# EasyEDA Pro project stm32wb09ke最小系统板_sma.eprj

# Schematic Schematic1
Board Name: Board1; Create Date: 2024-12-12; Page Name: P1; Project Name: stm32wb09ke最小系统板; Schematic Name: Schematic1; Update Date: 2025-01-03; Company: 东北林业大学; Page Size: A4; Version: V1.0
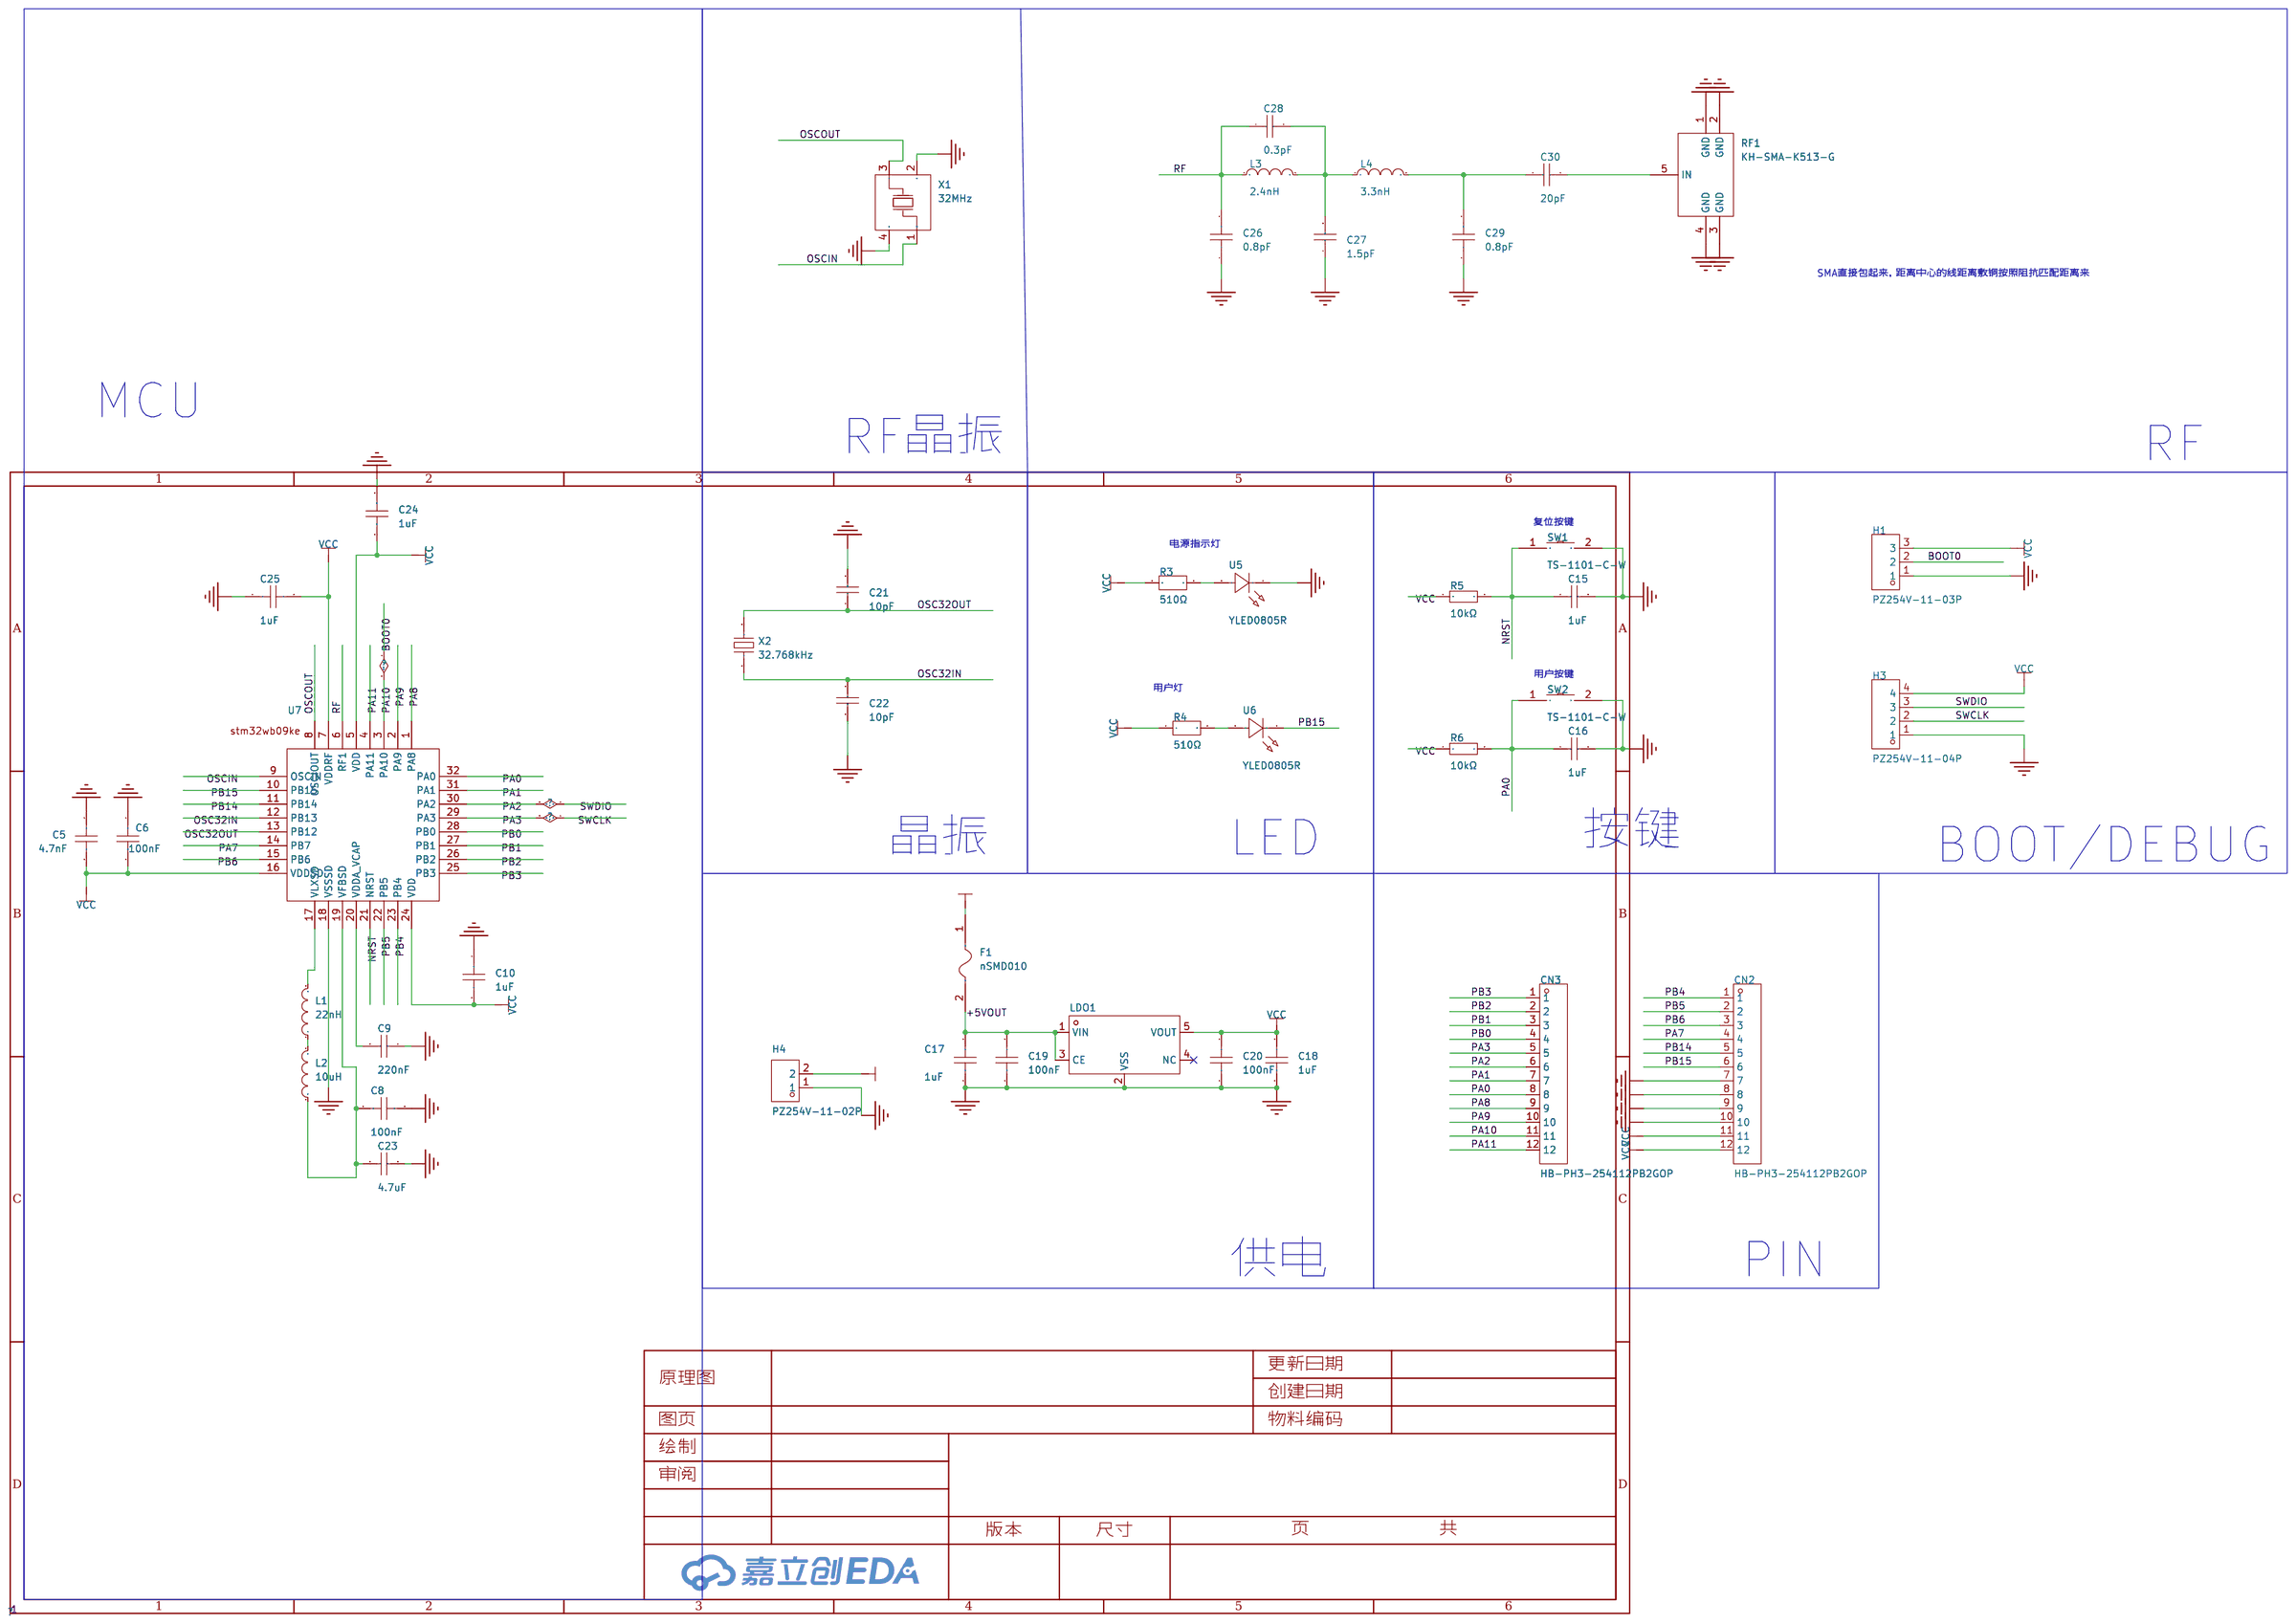
[diagram p0: schematic sheet]

## Parts
C5  4.7nF  [C0603]
C6  100nF  [C0603]
C8  100nF  [C0603]
C9  220nF  [C0603]
C10  1uF  [C0603]
C15  1uF  [C0805]
C16  1uF  [C0805]
C17  1uF  [C0603]
C18  1uF  [C0603]
C19  100nF  [C0603]
C20  100nF  [C0603]
C21  10pF  [C0603]
C22  10pF  [C0603]
C23  4.7uF  [C0603]
C24  1uF  [C0603]
C25  1uF  [C0603]
C26  0.8pF  [C0402]
C27  1.5pF  [C0402]
C28  0.3pF  [C0402]
C29  0.8pF  [C0402]
C30  20pF  [C0402]
CN2  HB-PH3-254112PB2GOP  [HDR-TH_12P-P2.54-V-M]
CN3  HB-PH3-254112PB2GOP  [HDR-TH_12P-P2.54-V-M]
F1  nSMD010  [F1206]
H1  PZ254V-11-03P  [HDR-TH_3P-P2.54-V-M]
H3  PZ254V-11-04P  [HDR-TH_4P-P2.54-V-M]
H4  PZ254V-11-02P  [HDR-TH_2P-P2.54-V-M]
L1  22nH  [IND-SMD_L1.6-W0.8-1]
L2  10uH  [L0805]
L3  2.4nH  [L0402]
L4  3.3nH  [L0402]
LDO1  ME6211C33M5G-N  [SOT-23-5_L3.0-W1.7-P0.95-LS2.8-BL]
R3  510Ω  [R0603]
R4  510Ω  [R0603]
R5  10kΩ  [R0805]
R6  10kΩ  [R0805]
RF1  KH-SMA-K513-G  [ANT-TH_KH-SMA-K513-G]
SW1  TS-1101-C-W  [SW-SMD_L6.0-W3.3-LS8.0]
SW2  TS-1101-C-W  [SW-SMD_L6.0-W3.3-LS8.0]
U5  YLED0805R  [LED0805-RD]
U6  YLED0805R  [LED0805-RD]
U7  -  [VFQFPN-32_L5.0-W5.0-P0.50-BL-EP3.1]
X1  32MHz  [CRYSTAL-SMD_4P-L3.2-W2.5-BL]
X2  32.768kHz  [OSC-SMD_L3.2-W1.5]

## Library data of the parts
C5 = CGA0603X7R472K500JT: LCSC Part Name: 4.7nF ±10% 50V; Supplier Part: C7503499; Manufacturer: HRE(芯声); Supplier Footprint: 0603; JLCPCB Part Class: 扩展库; Supplier: LCSC; Tolerance: ±10%; Voltage Rated: 50V; Temperature Coefficient: X7R
C6 C8 C19 C20 = CGA0603X7R104K500JT: LCSC Part Name: 100nF ±10% 50V; Supplier Part: C6119867; Manufacturer: HRE(芯声); Supplier Footprint: 0603; JLCPCB Part Class: 扩展库; Supplier: LCSC; Tolerance: ±10%; Voltage Rated: 50V; Temperature Coefficient: X7R
C9 = CL10B224KA8NNNC: LCSC Part Name: 220nF ±10% 25V; Supplier Part: C21120; Manufacturer: SAMSUNG(三星); Supplier Footprint: 0603; JLCPCB Part Class: 基础库; Datasheet: https://atta.szlcsc.com/upload/public/pdf/source/20160218/1457707763339.pdf; Supplier: LCSC; Tolerance: ±10%; Voltage Rated: 25V; Temperature Coefficient: X7R
C10 C17 C18 C24 C25 = CGA0603X5R105K160JT: LCSC Part Name: 1uF ±10% 16V; Supplier Part: C6119849; Manufacturer: HRE(芯声); Supplier Footprint: 0603; JLCPCB Part Class: 扩展库; Supplier: LCSC; Tolerance: ±10%; Voltage Rated: 16V; Temperature Coefficient: X5R
C15 C16 = CL21B105KBFNNNE: 容值:1uF;精度:±10%;额定电压:50V;材质(温度系数):X7R;; LCSC Part Name: 1uF ±10% 50V; Supplier Part: C28323; Manufacturer: SAMSUNG(三星); Supplier Footprint: 0805; JLCPCB Part Class: 基础库; Datasheet: https://atta.szlcsc.com/upload/public/pdf/source/20160218/1457707763339.pdf; Supplier: LCSC; Tolerance: ±10%; Voltage Rated: 50V; Temperature Coefficient: X7R
C21 C22 = CC0603JRNPO9BN100: LCSC Part Name: 10pF ±5% 50V; Supplier Part: C106245; Manufacturer: YAGEO(国巨); Supplier Footprint: 0603; JLCPCB Part Class: 扩展库; Datasheet: https://atta.szlcsc.com/upload/public/pdf/source/20170505/1493957838062.pdf; Supplier: LCSC; Tolerance: ±5%; Voltage Rated: 50V; Temperature Coefficient: NP0
C23 = CL10A475KO8NNNC: LCSC Part Name: 4.7uF ±10% 16V; Supplier Part: C19666; Manufacturer: SAMSUNG(三星); Supplier Footprint: 0603; JLCPCB Part Class: 基础库; Datasheet: https://atta.szlcsc.com/upload/public/pdf/source/20160218/1457707763339.pdf; Supplier: LCSC; Tolerance: ±10%; Voltage Rated: 16V; Temperature Coefficient: X5R
C26 C29 = GJM1555C1HR80WB01D: LCSC Part Name: 0.8pF 50V; Supplier Part: C88902; Manufacturer: muRata(村田); Supplier Footprint: 0402; JLCPCB Part Class: 扩展库; Datasheet: https://atta.szlcsc.com/upload/public/pdf/source/20190904/C426118_85E81C7C1F21FC87C5FB6D536E0847B4.pdf; Supplier: LCSC; Voltage Rated: 50V; Temperature Coefficient: C0G
C27 = GJM1555C1H1R5WB01D: LCSC Part Name: 1.5pF 50V; Supplier Part: C76901; Manufacturer: muRata(村田); Supplier Footprint: 0402; JLCPCB Part Class: 扩展库; Datasheet: https://atta.szlcsc.com/upload/public/pdf/source/20180326/C76901_35AAC13796FF1C4F89C7FD46F40EAEE1.pdf; Supplier: LCSC; Voltage Rated: 50V
C28 = GJM1555C1HR30WB01D: LCSC Part Name: 0.3pF 50V; Supplier Part: C76909; Manufacturer: muRata(村田); Supplier Footprint: 0402; JLCPCB Part Class: 扩展库; Datasheet: https://atta.szlcsc.com/upload/public/pdf/source/20180307/C76909_15204090774201407699.pdf; Supplier: LCSC; Voltage Rated: 50V; Temperature Coefficient: C0G
C30 = 0402CG200J500NT: LCSC Part Name: 20pF ±5% 50V; Supplier Part: C1554; Manufacturer: FH(风华); Supplier Footprint: 0402; JLCPCB Part Class: 基础库; Datasheet: https://atta.szlcsc.com/upload/public/pdf/source/20200305/C486355_26A10D38EF8C2A5C37091D0039909270.pdf; Supplier: LCSC; Tolerance: ±5%; Voltage Rated: 50V; Temperature Coefficient: C0G
CN2 CN3 = HB-PH3-254112PB2GOP: LCSC Part Name: 间距:2.54mm 1x12P 直插 方针; Supplier Part: C6332195; Manufacturer: HANBO(汉博); Supplier Footprint: 插件,P=2.54mm; JLCPCB Part Class: 扩展库; Datasheet: https://atta.szlcsc.com/upload/public/pdf/source/20230803/F72D259687963761DF1B552F3BB84A31.pdf; Supplier: LCSC; Pin Structure: 1x12P; Pitch: 2.54mm; Row Spacing: 2.54mm; Circluar Pins/Square Pins: 方针; Mounting Type: 直插; Number of Rows: 单排; Number of Pins: 12P; Current Rating (Max): 3A; Voltage Rating (Max): 250V; Length of Mating Pin: 6mm; Insulation Height: 2.54mm; Length of End Connection Pin: 3mm; Contact Material: 黄铜; Contact Plating: 金; Operating Temperature Range: -40℃~+105℃; Soldering Temperature(Max): 260℃; Color: 黑色
F1 = nSMD010: LCSC Part Name: 0.10A 60V 自恢复保险丝; Supplier Part: C70065; Manufacturer: 台湾陆海; Supplier Footprint: 1206; JLCPCB Part Class: 扩展库; Datasheet: https://atta.szlcsc.com/upload/public/pdf/source/20230404/ADB19886462D98F83AD677B1F8114E76.pdf; Supplier: LCSC; Operating Voltage (Max): 60V; Current Rating (Max): 40A; Hold Current: 100mA; Trip Current: 250mA; Power Dissipation: -；-；-；-; Operating Temperature: -40℃~+85℃
H1 = PZ254V-11-03P: LCSC Part Name: 间距:2.54mm 1x3P 直插 方针; Supplier Part: C2937625; Manufacturer: XFCN(兴飞); Supplier Footprint: 插件,P=2.54mm; JLCPCB Part Class: 扩展库; Datasheet: https://atta.szlcsc.com/upload/public/pdf/source/20200309/C492402_8335C3D49C4E4C618838D59BB1D024C1.pdf; Supplier: LCSC; Pin Structure: 1x3P; Pitch: 2.54mm; Circluar Pins/Square Pins: 方针; Mounting Type: 直插; Number of Rows: 单排; Number of Pins: 3P; Current Rating (Max): 3A; Voltage Rating (Max): 250V; Length of Mating Pin: 6mm; Insulation Height: 2.5mm; Length of End Connection Pin: 3mm; Operating Temperature Range: -40℃~+105℃; Color: 黑色
H3 = PZ254V-11-04P: LCSC Part Name: 间距:2.54mm 1x4P 直插 方针; Supplier Part: C2691448; Manufacturer: XFCN(兴飞); Supplier Footprint: 插件,P=2.54mm; JLCPCB Part Class: 扩展库; Datasheet: https://atta.szlcsc.com/upload/public/pdf/source/20200309/C492403_F9F19131791D08044AD4F84F8E751A34.pdf; Supplier: LCSC; Pin Structure: 1x4P; Pitch: 2.54mm; Circluar Pins/Square Pins: 方针; Mounting Type: 直插; Number of Rows: 单排; Number of Pins: 4P; Current Rating (Max): 3A; Voltage Rating (Max): 250V; Length of Mating Pin: 6mm; Insulation Height: 2.5mm; Length of End Connection Pin: 3mm; Operating Temperature Range: -40℃~+105℃; Color: 黑色
H4 = PZ254V-11-02P: LCSC Part Name: 间距:2.54mm 1x2P 直插 方针; Supplier Part: C492401; Manufacturer: XFCN(兴飞); Supplier Footprint: 插件,P=2.54mm; JLCPCB Part Class: 扩展库; Datasheet: https://atta.szlcsc.com/upload/public/pdf/source/20200309/C492401_A812433581A9B211A7FFA413ADDFF0E5.pdf; Supplier: LCSC; Pin Structure: 1x2P; Pitch: 2.54mm; Circluar Pins/Square Pins: 方针; Mounting Type: 直插; Number of Rows: 单排; Number of Pins: 2P; Length of Mating Pin: 6mm; Insulation Height: 2.5mm; Length of End Connection Pin: 3mm; Contact Material: 黄铜; Operating Temperature Range: -40℃~+105℃; Color: 黑色
L1 = LQW18AN22NG10D: LCSC Part Name: 22nH ±2%; Supplier Part: C162643; Manufacturer: muRata(村田); Supplier Footprint: 0603; JLCPCB Part Class: 扩展库; Datasheet: https://atta.szlcsc.com/upload/public/pdf/source/20180509/C162643_85EF45ECB5B52277646B8D922D19C79B.pdf; Supplier: LCSC; Tolerance: ±2%; Rated Current: 640mA; DC Resistance (DCR): 99mΩ
L2 = MGFL2012F100MT-LF: LCSC Part Name: 10uH ±20%; Supplier Part: C281113; Manufacturer: microgate(麦捷科技); Supplier Footprint: 0805; JLCPCB Part Class: 扩展库; Datasheet: https://atta.szlcsc.com/upload/public/pdf/source/20181025/C281113_18633E3AF8F2E9832A865B8532475DE8.pdf; Supplier: LCSC; Tolerance: ±20%; Rated Current: 500mA; DC Resistance (DCR): 320mΩ
L3 = LQW15AN2N4C00D: Supplier Part: C167473; Manufacturer: muRata(村田); Supplier Footprint: 0402; JLCPCB Part Class: 扩展库; Datasheet: https://atta.szlcsc.com/upload/public/pdf/source/20191016/C437364_463D6516B3BAE72B1DA0754F3D9B8308.pdf; Supplier: LCSC; Rated Current: 850mA; DC Resistance (DCR): 50mΩ
L4 = LQG15HS3N3B02D: Supplier Part: C162542; Manufacturer: muRata(村田); Supplier Footprint: 0402; JLCPCB Part Class: 扩展库; Datasheet: https://atta.szlcsc.com/upload/public/pdf/source/20190301/C337910_27DA25781C95F885577870A93A746ADF.pdf; Supplier: LCSC; Rated Current: 800mA; DC Resistance (DCR): 125mΩ; Q @ Freq: 8@100MHz; Frequency - Self Resonant: 6GHz
LDO1 = ME6211C33M5G-N: 输出类型:固定;输出极性:正;最大输入电压:6V;输出电压:3.3V;输出电流:500mA;电源纹波抑制比(PSRR):70dB;; Supplier Part: C82942; Manufacturer: MICRONE(南京微盟); Supplier Footprint: SOT-23-5; JLCPCB Part Class: 扩展库; Datasheet: https://atta.szlcsc.com/upload/public/pdf/source/20170918/C82942_1505727073070976520.pdf; Supplier: LCSC; Output Type: 固定; Output Polarity: 正; Number of Outputs: 1; Maximum Input Voltage: 6V; Output Voltage: 3.3V; Dropout Voltage: 260mV@(200mA); Output Current: 500mA; Power Supply Rejection Ratio (PSRR): 70dB
R3 R4 = FRC0603J511 TS: LCSC Part Name: 510Ω ±5% 100mW 厚膜电阻; Supplier Part: C2907179; Manufacturer: FOJAN(富捷); Supplier Footprint: 0603; JLCPCB Part Class: 扩展库; Datasheet: https://atta.szlcsc.com/upload/public/pdf/source/20211221/925EC7D7225764EE0046F22065062C87.pdf; Supplier: LCSC; Type: 厚膜电阻; Tolerance: ±5%; Power(Watts): 100mW; Overload Voltage (Max): 75V; Temperature Coefficient: ±100ppm/℃; Operating Temperature Range: -55℃~+155℃
R5 R6 = 0805W8J0103T5E: 电阻类型:厚膜电阻;阻值:10kΩ;精度:±5%;功率:125mW;最大工作电压:150V;温度系数:±100ppm/℃;; LCSC Part Name: 10kΩ ±5% 125mW 厚膜电阻; Supplier Part: C25612; Manufacturer: UNI-ROYAL(厚声); Supplier Footprint: 0805; JLCPCB Part Class: 扩展库; Datasheet: https://atta.szlcsc.com/upload/public/pdf/source/20200306/C422600_1E6D84923E4A46A82E41ADD87F860B5C.pdf; Supplier: LCSC; Type: 厚膜电阻; Tolerance: ±5%; Power(Watts): 125mW; Overload Voltage (Max): 150V; Temperature Coefficient: ±100ppm/℃; Operating Temperature Range: -55℃~+155℃
RF1 = KH-SMA-K513-G: LCSC Part Name: SMA 内孔 弯头; Supplier Part: C411575; Manufacturer: kinghelm(金航标); Supplier Footprint: 插件; JLCPCB Part Class: 扩展库; Datasheet: https://atta.szlcsc.com/upload/public/pdf/source/20210317/C411575_49039CD64129040639EC5218E5A2C783.pdf; Supplier: LCSC; Connector Type: 板端; Interface Type: 内孔; Number of Ports: 1; Frequency-Max: 6GHz; RF Series: SMA; Impedance: 50Ω; Style: 弯头; Operating Temperature Range: -55℃~+155℃
SW1 SW2 = TS-1101-C-W: 电路结构:单刀单掷;按钮形状:矩形按钮;作用力:260gf;安装方式:立贴;开关长度:6mm;开关宽度:3.6mm;开关高度:2.5mm;带支架:不带;触点电流:50mA;额定电压(AC):-;额定电压(DC):12V;额定功率:-;绝缘电阻:-;带灯:无;机械寿命:5万次;; LCSC Part Name: 6*3.6*2.5mm 立贴 轻触开关; Supplier Part: C318938; Manufacturer: XKB Connectivity(中国星坤); Supplier Footprint: SMD; JLCPCB Part Class: 扩展库; Datasheet: https://atta.szlcsc.com/upload/public/pdf/source/20200227/C318938_C2E53B1EEDE37D980A33616AC086DE53.pdf; Supplier: LCSC; Circuit: 单刀单掷; Actuator Style: 矩形按钮; Operating Force: 260gf; Mounting Style: 立贴; Switch Length: 6mm; Switch Width: 3.6mm; Switch Height: 2.5mm; Strike Gundam: 不带; Contact Current: 50mA; Voltage Rating (DC): 12V; Actuator/Cap Color: 白色带淡绿; With Lamp: 无; Mechanical Life: 5万次; Operating Temperature: -30℃~+85℃
U5 U6 = YLED0805R: 发光颜色:红色;正向电压(VF):1.8V~2.4V;功率:60mW;正向电流:20mA;主波长:615nm~630nm;二极管配置:-;透镜颜色:-;色温:-;发光强度:-;发光角度:-;载带方式:-;工作温度:-40℃~+85℃;; Supplier Part: C19171391; Manufacturer: YONGYUTAI(永裕泰); Supplier Footprint: 0805; JLCPCB Part Class: 扩展库; Datasheet: https://atta.szlcsc.com/upload/public/pdf/source/20231027/AB486D22E6D71BC59190C48A798367E6.pdf; Supplier: LCSC; Emitted Color: 红色; Forward Voltage (VF): 1.8V~2.4V; Power Dissipation: 60mW; Forward Current: 20mA; Dominant Wavelength: 615nm~630nm; Peak Wavelength: 645nm; Operating Temperature: -40℃~+85℃
U7 = stm32wb09ke
X1 = X322532MOB4SI: LCSC Part Name: 32MHz ±10ppm 12pF; Supplier Part: C9009; Manufacturer: YXC(扬兴晶振); Supplier Footprint: SMD3225-4P; JLCPCB Part Class: 扩展库; Datasheet: https://atta.szlcsc.com/upload/public/pdf/source/20240329/19D5F850207469550BEB00D7DFEDBC7A.pdf; Supplier: LCSC; Crystal Type: 贴片晶振; Normal temperature Frequency Tolerance: ±10ppm; External load capacitor: 12pF; Frequency Stability(Full temperature range): ±20ppm; Operating Temperature: -40℃~+85℃
X2 = X321532768KGD2SI: LCSC Part Name: 32.768kHz ±20ppm 12.5pF; Supplier Part: C620155; Manufacturer: YXC(扬兴晶振); Supplier Footprint: SMD3215-2P; JLCPCB Part Class: 扩展库; Datasheet: https://atta.szlcsc.com/upload/public/pdf/source/20240329/3A7650FD985DD0DE85694D3785AB4916.pdf; Supplier: LCSC; Crystal Type: 贴片晶振; Normal temperature Frequency Tolerance: ±20ppm; External load capacitor: 12.5pF; Operating Temperature: -40℃~+85℃

## Nets
+5VIN: F1.1 H4.2
+5VOUT: C17.2 C19.2 F1.2 LDO1.1(VIN) LDO1.3(CE)
GND: C5.1 C6.1 C8.1 C9.1 C10.1 C15.2 C16.2 C17.1 C18.1 C19.1 C20.1 C21.2 C22.1 C23.2 C24.2 C25.1 C26.1 C27.1 C29.1 CN2.7 CN2.8 CN2.9 CN2.10 H1.1 H3.1 H4.1 LDO1.2(VSS) RF1.1(GND) RF1.2(GND) RF1.3(GND) RF1.4(GND) SW1.2 SW2.2 U5.1(K) U7.18(VSSSD) X1.2(GND) X1.4(GND)
VCC: C5.2 C6.2 C10.2 C18.2 C20.2 C24.1 C25.2 CN2.11 CN2.12 H1.3 H3.4 LDO1.5(VOUT) R3.2 R4.1 R5.1 R6.1 U7.5(VDD) U7.7(VDDRF) U7.16(VDDSD) U7.24(VDD)
BOOT0: CN3.11 H1.2 U7.3(PA10)
NRST: C15.1 R5.2 SW1.1 U7.21(NRST)
OSC32IN: C22.2 U7.12(PB13) X2.1
OSC32OUT: C21.1 U7.13(PB12) X2.2
OSCIN: U7.9(OSCIN) X1.1(OSC1)
OSCOUT: U7.8(OSCIOUT) X1.3(OSC2)
PA0: C16.1 CN3.8 R6.2 SW2.1 U7.32(PA0)
PA1: CN3.7 U7.31(PA1)
PA2: CN3.6 H3.3 U7.30(PA2)
PA3: CN3.5 H3.2 U7.29(PA3)
PA7: CN2.4 U7.14(PB7)
PA8: CN3.9 U7.1(PA8)
PA9: CN3.10 U7.2(PA9)
PA11: CN3.12 U7.4(PA11)
PB0: CN3.4 U7.28(PB0)
PB1: CN3.3 U7.27(PB1)
PB2: CN3.2 U7.26(PB2)
PB3: CN3.1 U7.25(PB3)
PB4: CN2.1 U7.23(PB4)
PB5: CN2.2 U7.22(PB5)
PB6: CN2.3 U7.15(PB6)
PB14: CN2.5 U7.11(PB14)
PB15: CN2.6 U6.1(K) U7.10(PB15)
RF: C26.2 C28.1 L3.1 U7.6(RF1)
$1N758: C9.2 U7.20(VDDA_VCAP)
$1N1922: C29.2 C30.1 L4.2
$1N2702: L1.1 L2.2
$1N2707: C8.2 C23.1 L2.1 U7.19(VFBSD)
$1N2802: L1.2 U7.17(VLXSD)
$1N4450: R3.1 U5.2(A)
$1N4623: R4.2 U6.2(A)
$1N28589: C27.2 C28.2 L3.2 L4.1
$1N28889: C30.2 RF1.5(IN)

Not connected (* = marked no-connect by the designer): LDO1 4(NC)*

## Notes on the sheet
- SMA直接包起来，距离中心的线距离敷铜按照阻抗匹配距离来
- MCU
- RF晶振
- RF
- 复位按键
- 电源指示灯
- 用户按键
- 用户灯
- 晶振
- LED
- 按键
- BOOT/DEBUG
- 供电
- PIN

# Board PCB1
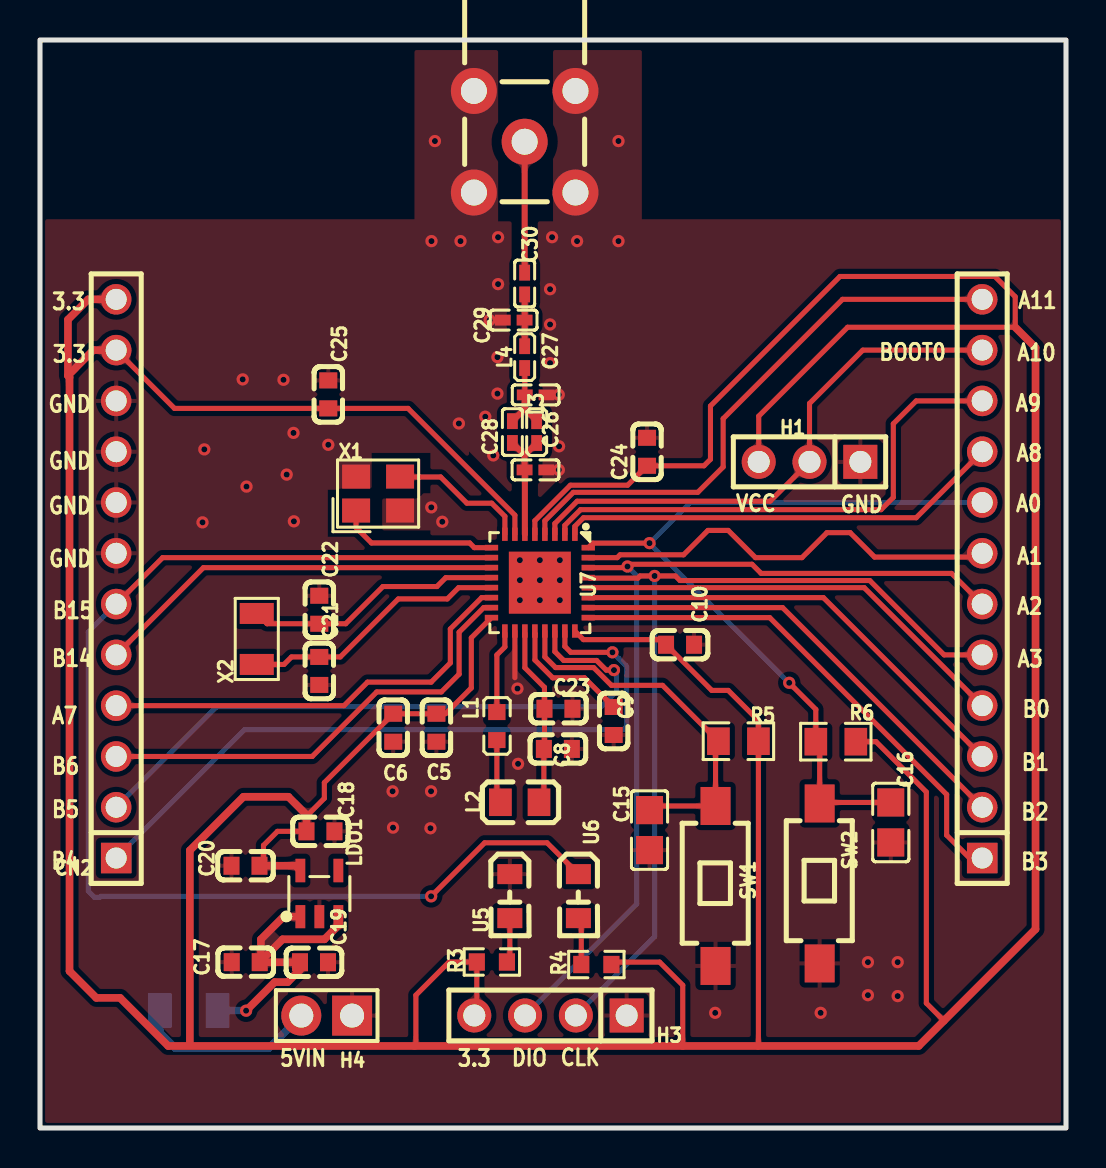
[diagram p1: board, top side]
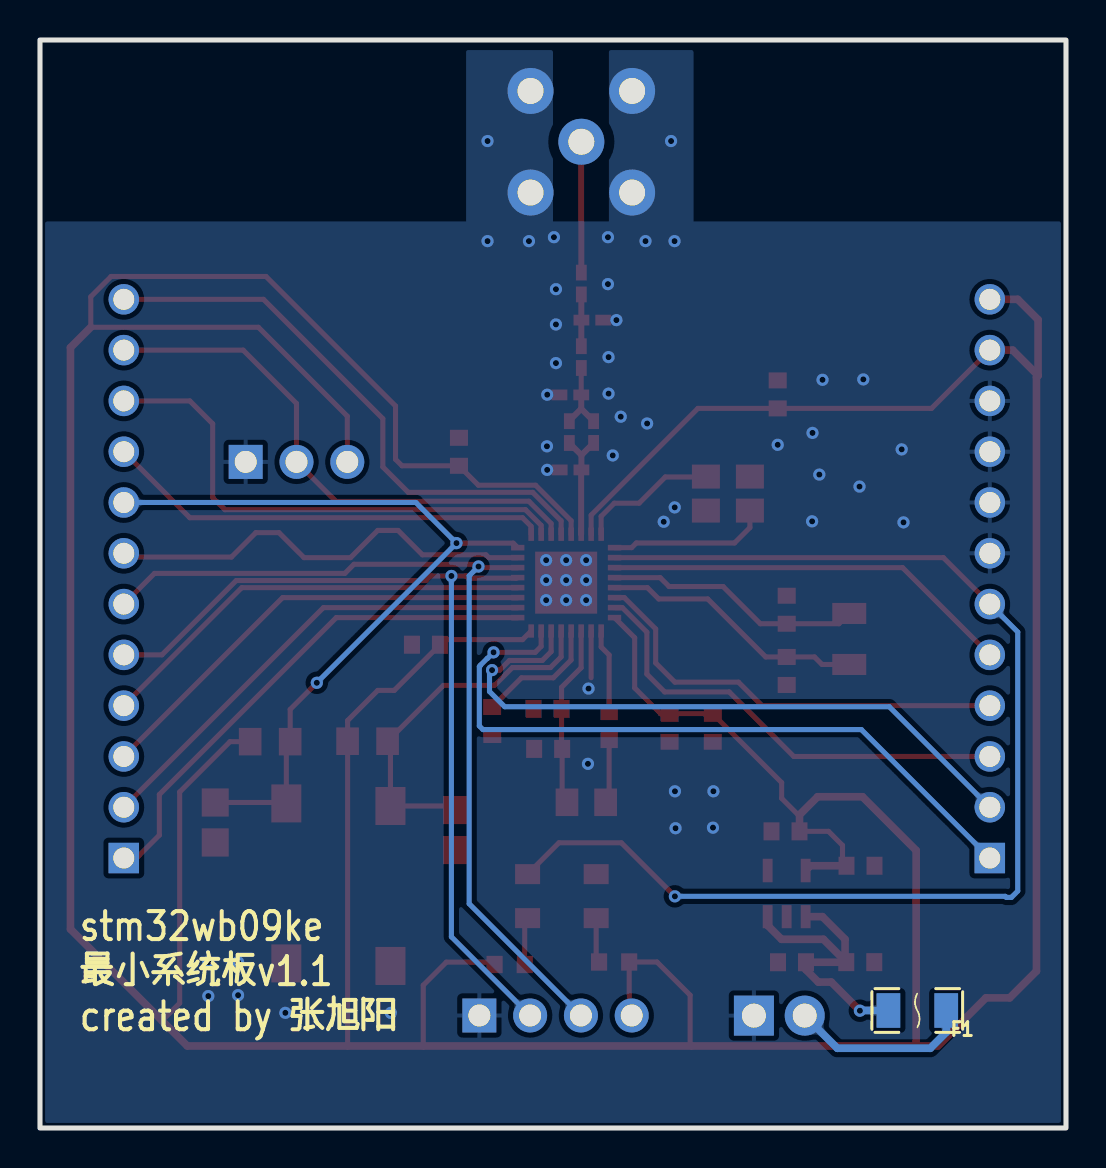
[diagram p2: board, bottom side, seen from below]

Outline 51.31 x 54.41 mm; copper layers: Top Layer, Bottom Layer. Coordinates in mm from the lower left corner of the outline.
Outline path: rectangle 0,54.41 51.31,0
Stack: Top Layer 0.0406mm / Dielectric1 1.51mm FR4 er 4.4 / Bottom Layer 0.0406mm

## Design rules (mm)
template: 自定义配置
spacing copperThickness1oz (default): track to track 0.102, other pairs 0.152 to 0.3
spacing copperThickness2oz: track to track 0.203, other pairs 0.152 to 0.3
track width copperThickness1oz (default): min 0.127, default 0.254, max 2.54
track width copperThickness2oz: min 0.203, default 0.254, max 2.54
differential pair differentialPair (default): width min 0.127, default 0.254, max 2.54; gap min 0.152, default 0.152
via viaSize (default): diameter min 0.5, default 0.61, max 10; hole min 0.3, default 0.305, max 6.3

## Placement (name value [footprint] x y rotation side)
C5  4.7nF  [C0603]  19.82 20.02 90 top
C6  100nF  [C0603]  17.66 20.02 90 top
C8  100nF  [C0603]  25.9 18.96 180 top
C9  220nF  [C0603]  28.69 20.35 90 top
C10  1uF  [C0603]  32.01 24.17 180 top
C15  1uF  [C0805]  30.48 14.9 270 top
C16  1uF  [C0805]  42.55 15.28 270 top
C17  1uF  [C0603]  10.29 8.29 0 top
C18  1uF  [C0603]  14.03 14.83 180 top
C19  100nF  [C0603]  13.7 8.29 180 top
C20  100nF  [C0603]  10.28 13.11 0 top
C21  10pF  [C0603]  13.97 22.86 270 top
C22  10pF  [C0603]  13.97 25.92 270 top
C23  4.7uF  [C0603]  25.93 20.97 0 top
C24  1uF  [C0603]  30.36 33.82 90 top
C25  1uF  [C0603]  14.42 36.69 270 top
C26  0.8pF  [C0402]  24.78 32.91 180 top
C27  1.5pF  [C0402]  24.79 36.66 180 top
C28  0.3pF  [C0402]  23.62 34.8 90 top
C29  0.8pF  [C0402]  23.69 40.4 0 top
C30  20pF  [C0402]  24.24 42.23 90 top
CN2  HB-PH3-254112PB2GOP  [HDR-TH_12P-P2.54-V-M]  3.81 27.47 90 top
CN3  HB-PH3-254112PB2GOP  [HDR-TH_12P-P2.54-V-M]  47.12 27.47 90 top
F1  nSMD010  [F1206]  7.44 5.88 0 bottom
H1  PZ254V-11-03P  [HDR-TH_3P-P2.54-V-M]  38.48 33.31 180 top
H3  PZ254V-11-04P  [HDR-TH_4P-P2.54-V-M]  25.53 5.63 180 top
H4  PZ254V-11-02P  [HDR-TH_2P-P2.54-V-M]  14.34 5.62 180 top
L1  22nH  [IND-SMD_L1.6-W0.8-1]  22.85 20.1 270 top
L2  10uH  [L0805]  23.99 16.29 180 top
L3  2.4nH  [L0402]  24.84 34.8 90 top
L4  3.3nH  [L0402]  24.24 38.55 90 top
LDO1  ME6211C33M5G-N  [SOT-23-5_L3.0-W1.7-P0.95-LS2.8-BL]  13.97 11.72 0 top
R3  510Ω  [R0603]  22.6 8.3 180 top
R4  510Ω  [R0603]  27.82 8.18 180 top
R5  10kΩ  [R0805]  34.92 19.34 180 top
R6  10kΩ  [R0805]  39.8 19.32 180 top
RF1  KH-SMA-K513-G  [ANT-TH_KH-SMA-K513-G]  24.24 49.32 270 top
SW1  TS-1101-C-W  [SW-SMD_L6.0-W3.3-LS8.0]  33.78 12.1 270 top
SW2  TS-1101-C-W  [SW-SMD_L6.0-W3.3-LS8.0]  38.99 12.23 270 top
U5  YLED0805R  [LED0805-RD]  23.49 11.6 270 top
U6  YLED0805R  [LED0805-RD]  26.92 11.6 270 top
U7  -  [VFQFPN-32_L5.0-W5.0-P0.50-BL-EP3.1]  25 27.27 180 top
X1  32MHz  [CRYSTAL-SMD_4P-L3.2-W2.5-BL]  16.91 31.73 0 top
X2  32.768kHz  [OSC-SMD_L3.2-W1.5]  10.84 24.46 270 top

## Footprints (pads in the part's own frame, mm; a bottom-side part is the same pattern mirrored in y, then rotated)
ANT-TH_KH-SMA-K513-G
  round 2.3 hole 1.3: 1(-2.54,-2.54) 2(-2.54,2.54) 3(2.54,2.54) 4(2.54,-2.54) 5(0,0)
C0402
  rect 0.79x0.54 smd: 1(-0.545,0) 2(0.545,0)
C0603
  rect 0.8x0.9 smd: 1(-0.7,0) 2(0.7,0)
C0805
  rect 1.41x1.35 smd: 1(-1,0) 2(1,0)
CRYSTAL-SMD_4P-L3.2-W2.5-BL
  rect 1.4x1.2 smd: 1(-1.1,-0.85) 2(1.1,-0.85) 3(1.1,0.85) 4(-1.1,0.85)
F1206
  rect 1.19x1.728 smd: 1(-1.445,0) 2(1.445,0)
HDR-TH_2P-P2.54-V-M
  rect 2x2 hole 1.2: 1(-1.27,0)
  round 2 hole 1.2: 2(1.27,0)
HDR-TH_3P-P2.54-V-M
  rect 1.7x1.7 hole 1.1: 1(-2.54,0)
  round 1.7 hole 1.1: 2(0,0) 3(2.54,0)
HDR-TH_4P-P2.54-V-M
  rect 1.7x1.7 hole 1.1: 1(-3.81,0)
  round 1.7 hole 1.1: 2(-1.27,0) 3(1.27,0) 4(3.81,0)
HDR-TH_12P-P2.54-V-M
  rect 1.524x1.524 hole 1.05: 1(-13.97,0)
  round 1.524 hole 1.05: 2(-11.43,0) 3(-8.89,0) 4(-6.35,0) 5(-3.81,0) 6(-1.27,0) 7(1.27,0) 8(3.81,0) 9(6.35,0) 10(8.89,0) 11(11.43,0) 12(13.97,0)
IND-SMD_L1.6-W0.8-1
  rect 0.8x0.864 smd: 1(0.7,0) 2(-0.7,0)
L0402
  rect 0.79x0.54 smd: 1(-0.545,0) 2(0.545,0)
L0805
  rect 1.133x1.377 smd: 1(-0.966,0) 2(0.966,0)
LED0805-RD
  rect 1x1.25 smd: 1(-1.1,0) 2(1.1,0)
OSC-SMD_L3.2-W1.5
  rect 1.05x1.7 smd: 1(-1.275,0) 2(1.275,0)
R0603
  rect 0.806x0.864 smd: 1(-0.753,0) 2(0.753,0)
R0805
  rect 1.133x1.377 smd: 1(-1,0) 2(1,0)
SOT-23-5_L3.0-W1.7-P0.95-LS2.8-BL
  rect 0.49x1.157 smd: 1(-0.95,-1.153) 2(0,-1.153) 3(0.95,-1.153)
  rect 0.49x1.175 smd: 4(0.95,1.153) 5(-0.95,1.153)
SW-SMD_L6.0-W3.3-LS8.0
  rect 1.9x1.5 smd: 1(-4,0) 2(4,0)
VFQFPN-32_L5.0-W5.0-P0.50-BL-EP3.1
  rect 0.28x0.665 smd: 1(-1.75,-2.42) 2(-1.25,-2.42) 3(-0.75,-2.42) 4(-0.25,-2.42) 5(0.25,-2.42) 6(0.75,-2.42) 7(1.25,-2.42) 8(1.75,-2.42) 17(1.75,2.42) 18(1.25,2.42) 19(0.75,2.42) 20(0.25,2.42) 21(-0.249,2.42) 22(-0.75,2.42) 23(-1.25,2.42) 24(-1.75,2.42)
  rect 0.665x0.28 smd: 9(2.42,-1.75) 10(2.42,-1.25) 11(2.42,-0.75) 12(2.42,-0.249) 13(2.42,0.251) 14(2.42,0.75) 15(2.42,1.25) 16(2.42,1.75) 25(-2.42,1.75) 26(-2.42,1.25) 27(-2.42,0.75) 28(-2.42,0.251) 29(-2.42,-0.249) 30(-2.42,-0.75) 31(-2.42,-1.25) 32(-2.42,-1.75)
  rect 3.1x3.1 smd: 33(0,0)

## Nets
As in the schematic.

Pads without a net: LDO1 4; U7 33

## Via types
v1: diameter 0.61, hole 0.305, Top Layer to Bottom Layer, 61 vias

## Routing (per net, layer and track width the routed paths; a pad name or vN(x,y) marks a point on that pad's centre or on a via; arc(x,y) is an arc through that point)
+5VIN: length 9.2
  Bottom Layer w0.381: H4.2 11.43,3.99 6.79,3.99 5.99,4.78 5.99,5.88
+5VOUT: length 16
  Top Layer w0.381: 11.05,8.36 C17.2 10.99,8.29 C19.2 13,7.91 12.39,7.3 11.74,7.3 v1(10.31,5.87) ; 11.05,8.36 12.13,9.44 14.22,9.44 14.92,10.13 14.92,10.57 ; 11.05,8.36 11.05,9.44 12.18,10.57 LDO1.1
  Bottom Layer w0.381: v1(10.31,5.87) 10.3,5.88 F1.2
GND: length 2.3
  Top Layer w0.254: U7.18 23.75,22.52
  vias: v1(8.13,30.29) v1(8.22,33.94) v1(10.14,37.44) v1(10.33,32.08) v1(12.18,37.42) v1(12.34,32.68) v1(12.68,34.76) v1(12.7,30.34) v1(14.42,34.17) v1(17.63,16.84) v1(17.65,15.02) v1(19.58,44.35) v1(19.57,31.04) v1(19.56,16.84) v1(19.53,14.99) v1(19.75,49.36) v1(20.12,30.32) v1(20.95,35.23) v1(21.03,44.35) v1(22.27,35.57) v1(22.48,40.4) v1(22.67,33.63) v1(22.88,38.55) v1(22.88,36.73) v1(22.91,44.55) v1(22.91,42.2) v1(23.88,21.98) v1(23.91,18.21) v1(24,28.4) v1(24,27.4) v1(24,26.4) v1(25,28.4) v1(25,27.4) v1(25,26.4) v1(25.51,41.95) v1(25.51,40.18) v1(25.51,38.25) v1(25.61,44.55) v1(25.94,36.67) v1(25.96,34.09) v1(25.95,32.91) v1(26,28.4) v1(26,27.4) v1(26,26.4) v1(26.86,44.35) v1(28.93,49.36) v1(28.93,44.35) v1(33.76,5.76) v1(39.04,5.76) v1(41.4,8.29) v1(41.4,6.64) v1(42.89,8.29) v1(42.89,6.6)
VCC: length 294.3
  Top Layer w0.254: 45.2,5.36 44.32,6.24 44.32,16.8 41.81,19.32 R6.1 ; U7.24 27.18,24.42 31.05,24.42 C10.2 33.59,21.88 34.42,21.88 35.92,20.37 R5.1 35.92,4.12 35.91,4.1 ; H1.3 35.94,35.6 40.39,40.04 48.77,40.04 48.77,41.57 47.75,42.58 40.01,42.58 33.53,36.11 33.53,33.44 33.2,33.12 C24.1 29.38,32.14 26.52,32.14 24.75,30.37 U7.5 ; 18.73,4.1 18.8,4.17 18.8,6.64 20.46,8.3 21.84,8.3 21.84,5.75 H3.4 ; U7.16 21.57,24.51 21.57,22.01 20.28,20.72 C5.2 C6.2 14.22,17.27 14.22,16.49 13.39,15.66 13.33,15.66 ; U7.7 23.75,30.65 18.41,35.99 C25.2 6.72,35.99 CN2.11 ; R4.1 28.69,8.29 30.99,8.29 32.14,7.14 32.14,4.1 ; C18.2 11.88,14.83 11.18,14.14 11.18,13.31 C20.2
  Top Layer w0.381: 1.4,37.63 1.48,37.55 1.48,7.85 2.82,6.51 4.01,6.51 6.41,4.1 43.94,4.1 49.78,9.94 49.78,39.03 48.77,40.04 ; 1.4,37.63 1.4,40.42 2.41,41.44 CN2.12 ; 1.4,37.63 2.67,38.9 CN2.11 ; C18.2 13.33,15.66 12.42,16.56 10.17,16.56 7.49,13.88 7.49,4.2 ; C20.2 12.78,13.11 LDO1.5
BOOT0: length 27.2
  Top Layer w0.254: CN3.11 41.15,38.9 38.48,36.23 H1.2 36.51,31.34 26.86,31.34 25.75,30.23 U7.3
NRST: length 18.4
  Top Layer w0.254: U7.21 25.25,23.56 25.78,23.03 27.69,23.03 28.58,22.14 31.13,22.14 R5.2 33.78,19.2 SW1.1 30.69,16.1 C15.1
OSC32IN: length 12.9
  Top Layer w0.254: U7.12 20.29,27.52 19.85,27.08 17.15,27.08 15.29,25.22 C22.2 11.35,25.22 X2.1
OSC32OUT: length 13.3
  Top Layer w0.254: U7.13 20.93,27.02 20.37,26.46 17.92,26.46 15.02,23.56 C21.1 12.58,23.56 12.2,23.18 X2.2
OSCIN: length 8
  Top Layer w0.254: X1.1 15.81,30.03 16.58,29.26 21.49,29.26 21.72,29.02 U7.9
OSCOUT: length 7
  Top Layer w0.254: U7.8 23.25,30.59 22.59,31.25 21.35,31.25 20.04,32.56 18.03,32.56 X1.3
PA0: length 40.6
  Top Layer w0.254: v1(37.46,22.26) 38.8,20.93 R6.2 ; U7.32 27.64,29.25 v1(30.48,29.25) ; 38.99,19.13 SW2.1 39.04,16.28 C16.1 ; 38.99,19.13 39.05,19.19
  Bottom Layer w0.254: CN3.8 32.51,31.28 v1(30.48,29.25) v1(37.46,22.26)
PA1: length 21.9
  Top Layer w0.254: CN3.7 46.93,28.55 41.73,28.55 40.51,29.77 39.35,29.77 38.1,28.52 35.78,28.52 34.42,29.88 33.4,29.88 32.18,28.66 29.01,28.66 28.86,28.52 U7.31
PA2: length 45.6
  Top Layer w0.254: CN3.6 45.58,27.73 36.06,27.73 35.61,28.19 29.49,28.19 v1(29.38,28.08) 29.32,28.02 U7.30
  Bottom Layer w0.254: H3.3 29.85,11.21 29.85,27.61 v1(29.38,28.08)
PA3: length 45
  Top Layer w0.254: U7.29 27.48,27.52 27.5,27.5 29.9,27.5 30.01,27.61 v1(30.73,27.61) 31.78,27.61 32,27.38 41.49,27.38 45.21,23.66 CN3.5
  Bottom Layer w0.254: v1(30.73,27.61) 30.73,9.56 H3.2
PA7: length 22
  Top Layer w0.254: U7.14 22.08,26.52 20.52,24.96 20.52,23.26 19.56,22.3 16.38,22.3 15.2,21.12 CN2.4
PA8: length 22.3
  Top Layer w0.254: U7.1 26.75,30.09 27.18,30.52 43.82,30.52 CN3.9
PA9: length 26.1
  Top Layer w0.254: CN3.10 43.82,36.36 42.67,35.22 42.67,31.53 42.06,30.92 27.03,30.92 26.25,30.14 U7.2
PA11: length 28.5
  Top Layer w0.254: U7.4 25.25,30.37 26.67,31.79 32.89,31.79 34.16,33.06 34.16,35.47 40.13,41.44 CN3.12
PB0: length 22.1
  Top Layer w0.254: U7.28 41.21,27.02 CN3.4
PB1: length 23
  Top Layer w0.254: U7.27 39.17,26.52 CN3.3
PB2: length 23.8
  Top Layer w0.254: U7.26 37.13,26.02 CN3.2
PB3: length 25.9
  Top Layer w0.254: CN3.1 46.48,13.5 45.34,14.64 45.34,16.68 36.49,25.52 U7.25
PB4: length 35.5
  Top Layer w0.254: U7.23 26.25,24.08 26.54,23.79 v1(28.63,23.79)
  Bottom Layer w0.254: v1(28.63,23.79) 28.93,23.48 28.94,23.48 29.29,23.14 29.29,23.13 29.34,23.08 29.34,20.1 29.16,19.93 10.23,19.93 CN2.1
PB5: length 32.9
  Top Layer w0.254: U7.22 25.75,23.82 26.19,23.38 27.83,23.38 28.32,22.9 v1(28.7,22.9)
  Bottom Layer w0.254: v1(28.7,22.9) 28.83,22.77 28.83,21.83 28.07,21.07 8.84,21.07 CN2.2
PB6: length 23.1
  Top Layer w0.254: U7.15 22.18,26.02 20.96,24.8 20.96,22.7 20.07,21.81 16.84,21.81 13.61,18.58 CN2.3
PB14: length 20.6
  Top Layer w0.254: CN2.5 8.17,28.02 U7.11
PB15: length 61.1
  Top Layer w0.254: CN2.6 6.13,28.52 U7.10 ; U6.1 25.36,14.26 22.24,14.26 v1(19.56,11.58)
  Bottom Layer w0.254: v1(19.56,11.58) 3.04,11.58 2.98,11.53 2.73,11.53 2.41,11.85 2.41,24.8 CN2.6
RF: length 5.7
  Top Layer w0.3: 24.23,33.65 24.84,34.25 ; 24.23,33.65 23.62,34.26 ; 24.23,33.65 24.23,32.91 24.25,32.9 U7.6
$1N758: length 6.2
  Top Layer w0.254: C9.2 27.23,22.51 25.64,22.51 24.75,23.4 24.75,24.72 24.75,24.73
$1N1922: length 2.6
  Top Layer w0.3: C30.1 24.24,40.41 C29.2 24.24,40.4 L4.2
$1N2702: length 3.2
  Top Layer w0.254: L2.2 22.85,16.47 L1.1
$1N2707: length 8.8
  Top Layer w0.254: 25.23,21.12 25.23,22.04 24.25,23.02 24.25,24.73 ; 25.2,21.11 25.19,21.12 ; C23.1 25.23,18.99 C8.2 25.2,16.53 L2.1
$1N2802: length 4.1
  Top Layer w0.254: L1.2 22.85,23.66 23.25,24.06 23.25,24.73
$1N4450: length 2.3
  Top Layer w0.254: R3.1 23.49,8.45 U5.2
$1N4623: length 2.4
  Top Layer w0.254: R4.2 27.07,10.35 U6.2
$1N28589: length 3.8
  Top Layer w0.254: L4.1 24.24,38 C27.2
  Top Layer w0.3: 24.24,35.97 C27.2 ; 24.24,35.97 C28.2 ; 24.24,35.97 24.84,35.37 L3.2
$1N28889: length 6.5
  Top Layer w0.3: C30.2 RF1.5

## Copper pours and planes (outline as drawn; the poured copper is in the pictures)
+5VOUT on Top Layer: 11.05,8.36 11.05,9.44 11.58,9.97 12.12,9.44 12.13,9.44
GND on Top Layer: 17.11,31.74 20.75,31.74 20.75,29.7 17.11,29.7
GND on Top Layer: 18.73,54.35 22.91,54.35 22.91,43.27 18.73,43.27
GND on Top Layer: 0,45.45 51.31,45.45 51.31,0 0,0
GND on Top Layer: 25.65,54.41 30.1,54.41 30.1,43.82 25.65,43.82
GND on Top Layer: 19.95,45.34 19.95,35.18 23.72,31.41 25.26,31.41 26.78,32.93 26.78,45.33 26.79,45.34 19.95,45.34
GND on Top Layer: 13.93,34.6 16.59,34.6 16.59,31.92 13.93,31.92
GND on Bottom Layer: 18.63,54.41 22.86,54.41 22.86,43.38 18.63,43.38
GND on Bottom Layer: 0,45.34 51.31,45.34 51.31,0 0,0
GND on Bottom Layer: 25.65,54.41 30,54.41 30,43.45 25.65,43.45
ANT on Top Layer: 56.1,57.7 53.62,57.7 53.62,58.51 62.55,58.51 62.55,60.11 53.62,60.11 53.62,60.91 62.57,60.91 62.57,62.51 55.96,62.51 55.96,62.11 62.17,62.11 62.17,61.31 53.22,61.31 53.22,59.7 62.15,59.7 62.15,58.9 53.22,58.9 53.22,57.3 55.7,57.3 55.7,56.2 56.1,56.2

Small or netless copper shapes (teardrops, artwork), in the pictures only: 112 on Top Layer, 17 on Bottom Layer

## Text on the board
Bottom Silkscreen Layer: stm32wb09ke / 最小系统板v1.1 / created by 张旭阳
Top Silkscreen Layer: 5VIN | 3.3 | DIO | CLK | VCC | GND | BOOT0 | B4 | B14 | A7 | B6 | B5 | B15 | A9 | A0 | A8 | A1 | A2 | A10 | A3 | A11 | B3 | B2 | B1 | B0
